# EAGLE schematic gamebuinolitev3 (EAGLE 6.5.0)
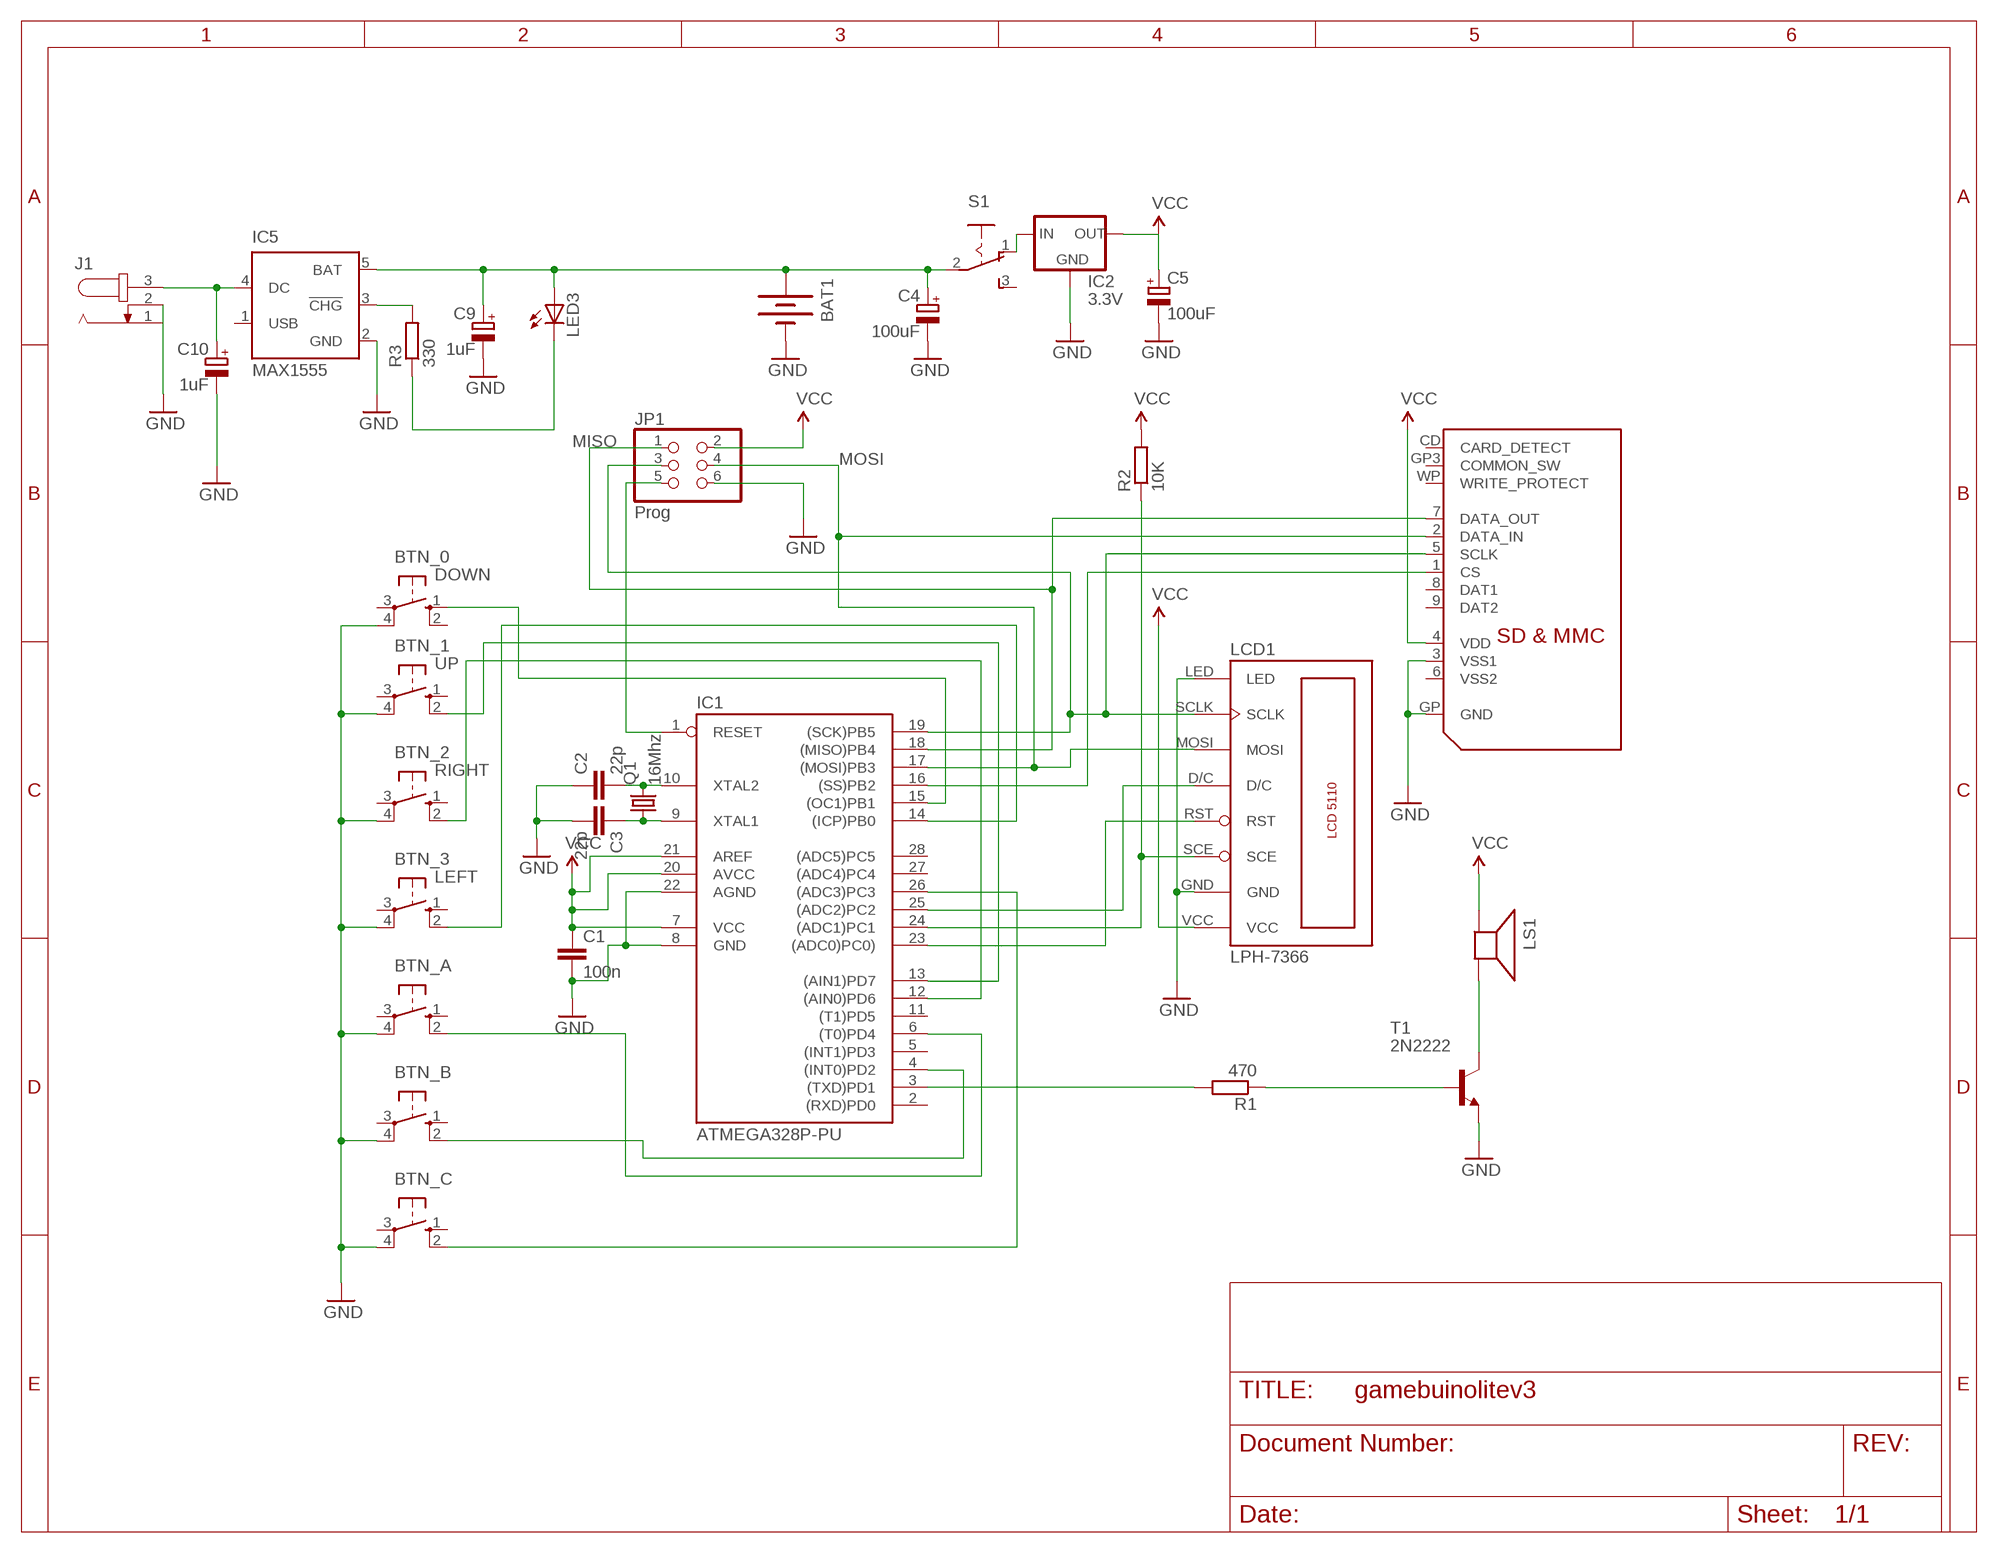
[diagram p0: schematic, sheet 1]

## Parts
BAT1  BATTERYLIPO-TABS  [LIPO-110-TABS]
BTN_0  DOWN  40-XX  [B3F-40XX]
BTN_1  UP  40-XX  [B3F-40XX]
BTN_2  RIGHT  40-XX  [B3F-40XX]
BTN_3  LEFT  40-XX  [B3F-40XX]
BTN_A  40-XX  [B3F-40XX]
BTN_B  40-XX  [B3F-40XX]
BTN_C  40-XX  [B3F-40XX]
C1  100n  C-EU050-024X044  [C050-024X044]
C2  22p  C-EU050-024X044  [C050-024X044]
C3  22p  C-EU050-024X044  [C050-024X044]
C4  100uF  CPOL-EUE2.5-7  [E2,5-7]
C5  100uF  CPOL-EUE2.5-7  [E2,5-7]
C9  1uF  CPOL-EUE2.5-7  [E2,5-7]
C10  1uF  CPOL-EUE2.5-7  [E2,5-7]
IC1  ATMEGA328P-PU  [DIL28-3]
IC2  3.3V  MCP1700INLINE  [TO92-INLINE]
IC5  MAX1555  [SOT23-5L]
J1  JACK-PLUG0  [SPC4077]
JP1  Prog  PINHD-2X3  [2X03]
LCD1  LPH-7366  [LPH-7366]
LED3  LED3MM  [LED3MM]
LS1  SPEAKER/PS12  [PS12]
Q1  16Mhz  CRYSTALHC49S  [HC49/S]
R1  470  R-EU_0204/7  [0204/7]
R2  10K  R-EU_0204/7  [0204/7]
R3  330  R-EU_0204/7  [0204/7]
S1  M251  [M251]
T1  2N2222  [TO92-EBC-OVAL]
U$6  SDMMC06132  [06132]

## Nets
GND: BAT1.- BTN_0.4(P1) BTN_1.4(P1) BTN_2.4(P1) BTN_3.4(P1) BTN_A.4(P1) BTN_B.4(P1) BTN_C.4(P1) C1.2 C2.1 C3.2 C4.- C5.- C9.- C10.- IC1.8(GND) IC1.22(AGND) IC5.2(GND) J1.1 J1.2 JP1.6 LCD1.GND LCD1.LED T1.E U$6.3(VSS1) U$6.GP(GND)
MISO: IC1.18((MISO)PB4) JP1.1 U$6.7(DATA_OUT)
MOSI: IC1.17((MOSI)PB3) JP1.4 LCD1.MOSI U$6.2(DATA_IN)
N$1: BTN_B.2(S1) IC1.4((INT0)PD2)
N$2: IC1.3((TXD)PD1) R1.2
N$3: BTN_A.2(S1) IC1.6((T0)PD4)
N$4: BTN_2.2(S1) IC1.12((AIN0)PD6)
N$5: C2.2 IC1.10(XTAL2) Q1.2
N$6: C3.1 IC1.9(XTAL1) Q1.1
N$8: BTN_1.2(S1) IC1.13((AIN1)PD7)
N$9: BTN_3.2(S1) IC1.14((ICP)PB0)
N$10: BTN_C.2(S1) IC1.26((ADC3)PC3)
N$11: IC1.25((ADC2)PC2) LCD1.D/C
N$12: LS1.P$2(-) T1.C
N$13: IC1.23((ADC0)PC0)) LCD1.RST
N$14: R1.1 T1.B
N$15: IC1.16((SS)PB2) U$6.1(CS)
N$16: BTN_0.1(S) IC1.15((OC1)PB1)
N$17: IC1.19((SCK)PB5) JP1.3 LCD1.SCLK U$6.5(SCLK)
N$18: IC1.24((ADC1)PC1) LCD1.SCE R2.1
N$19: C10.+ IC5.4(DC) J1.3
N$20: IC1.1(RESET) JP1.5
N$21: BAT1.+ C4.+ C9.+ IC5.5(BAT) LED3.A S1.2(P)
N$22: C5.+
N$23: IC2.2(IN) S1.1(O)
N$24: IC5.3(!CHG) R3.2
N$25: LED3.K(C) R3.1
VCC: C1.1 IC1.7(VCC) IC1.20(AVCC) IC1.21(AREF) IC2.3(OUT) JP1.2 LCD1.VCC LS1.P$1(+) R2.2
VDD: U$6.4(VDD) ; supply symbol labelled VCC
Unconnected: BTN_0.2(S1) BTN_0.3(P) BTN_1.1(S) BTN_1.3(P) BTN_2.1(S) BTN_2.3(P) BTN_3.1(S) BTN_3.3(P) BTN_A.1(S) BTN_A.3(P) BTN_B.1(S) BTN_B.3(P) BTN_C.1(S) BTN_C.3(P) IC1.2((RXD)PD0) IC1.5((INT1)PD3) IC1.11((T1)PD5) IC1.27((ADC4)PC4) IC1.28((ADC5)PC5) IC2.1(GND) IC5.1(USB) S1.3(S) U$6.6(VSS2) U$6.8(DAT1) U$6.9(DAT2) U$6.CD(CARD_DETECT) U$6.GP3(COMMON_SW) U$6.WP(WRITE_PROTECT)

## Library data of the parts
BAT1 = SparkFun-Electromechanical:BATTERY: Battery Holders Various common sizes : AA, AAA, 20mm coin cell and 12mm coin cell. 20MM_4LEGS, BATT-10373
BTN_0 BTN_1-BTN_3 BTN_A BTN_B BTN_C = switch-omron:40-XX: OMRON SWITCH; MF: OMRON COMPONENTS USA; MPN: B3F-4000; OC_FARNELL: 176434; OC_NEWARK: 36K3105
C1-C3 = rcl:C-EU: CAPACITOR, European symbol
C4 C5 C9 C10 = rcl:CPOL-EU: POLARIZED CAPACITOR, European symbol
IC1 = SmartPrj:ATMEGA328P-: MICROCONTROLLER 4 Kbytes FLASH 128 bytes SRAM 256 bytes EEPROM UART 6-channel 10 bit ADC
IC2 = adafruit:MCP1700: VOLTAGE REGULATOR
IC5 = maxim:MAX1555: Dual-Input USB/AC Adapter 1-Cell Li+ Battery Chargers Source: http://www.maxim-ic.com .. MAX1551-MAX1555.pdf; MF: MAXIM; MPN: MAX1555EZK+T; OC_FARNELL: 1628222; OC_NEWARK: 59J2761
J1 = con-jack:JACK-PLUG: DC POWER JACK Power Jack, DC, Right Angle, Through Hole, Rated 5A at 16VDC, PC Terminals Distributor: Farnell (www.Farnell.de) Drawing: 84N1161.pdf / 84N1162.pdf Manufacturer: SPC Technology (www.spctechnology.com) Type: SPC4077 / SPC 4078; OC_FARNELL: unknown; OC_NEWARK: unknown
JP1 = pinhead:PINHD-2X3: PIN HEADER
LCD1 = lcd5110:LPH-7366
LED3 = adafruit:LED: LED OSRAM: - CHIPLED LG R971, LG N971, LY N971, LG Q971, LY Q971, LO R971, LY R971 LH N974, LH R974 LS Q976, LO Q976, LY Q976 LO Q996 - Hyper CHIPLED LW Q18S LB Q993, LB Q99A, LB R99A - SideLED LS A670, LO A670, LY A670, LG A670, LP A670 LB A673, LV A673, LT A673, LW A673 LH A674 LY A675 LS A676, LA A676, LO A676, LY A676, LW A676 LS A679, LY A679, LG A679 - Hyper Micro SIDELED® LS Y876, LA Y876, LO Y876, LY Y876 LT Y87S - SmartLED LW L88C, LW L88S LB L89C, LB L89S, LG L890 LS L89K, LO L89K, LY L89K LS L896, LA L896, LO L896, LY L896 - TOPLED LS T670, LO T670, LY T670, LG T670, LP T670 LSG T670, LSP T670, LSY T670, LOP T670, LYG T670 LG T671, LOG T671, LSG T671 LB T673, LV T673, LT T673, LW T673 LH T674 LS T676, LA T676, LO T676, LY T676, LB T676, LH T676, LSB T676, LW T676 LB T67C, LV T67C, LT T67C, LS T67K, LO T67K, LY T67K, LW E67C LS E67B, LA E67B, LO E67B, LY E67B, LB E67C, LV E67C, LT E67C LW T67C LS T679, LY T679, LG T679 LS T770, LO T770, LY T770, LG T770, LP T770 LB T773, LV T773, LT T773, LW T773 LH T774 LS E675, LA E675, LY E675, LS T675 LS T776, LA T776, LO T776, LY T776, LB T776 LHGB T686 LT T68C, LB T68C - Hyper Mini TOPLED® LB M676 - Mini TOPLED Santana® LG M470 LS M47K, LO M47K, LY M47K Source: http://www.osram.convergy.de/
LS1 = adafruit:SPEAKER: SPEAKER Source: Buerklin Added PS12 (for part # PS1240 piezo) http://www.ladyada.net/library/pcb/eaglelibrary.html
Q1 = adafruit:CRYSTAL: CRYSTAL; OC_FARNELL: 1667008; OC_NEWARK: unknown
R1-R3 = rcl:R-EU_: RESISTOR, European symbol
S1 = switch:M251: SLIDING SWITCH Mors, distributor Buerklin, 11G702
T1 = adafruit:2N2222: NPN TRANSISTOR Big oval pads
U$6 = adafruit:SDMMC: SD MMC Card holder 4UCON part #06132 - easy to solder

## Net classes
0 default: width 0.203 mm
1 power: width 0.203 mm